# EAGLE design HV DC-DC (EAGLE 7.4.0)
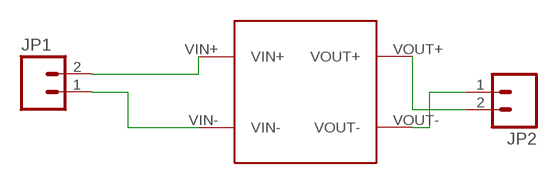
[diagram p0: schematic, sheet 1]

## Parts
JP1  M02LOCK  [1X02_LOCK]
JP2  M02LOCK  [1X02_LOCK]
U$1  RUW15SL12C  [RUW15SL12C]

## Nets
N$1: JP1.1 U$1.VIN-
N$2: JP1.2 U$1.VIN+
N$3: JP2.1 U$1.VOUT-
N$4: JP2.2 U$1.VOUT+

## Library data of the parts
JP1 JP2 = SparkFun-Connectors:M02: Standard 2-pin 0.1" header. Use with - straight break away headers ( PRT-00116) - right angle break away headers (PRT-00553) - swiss pins (PRT-00743) - machine pins (PRT-00117) - female headers (PRT-00115) Molex polarized connector foot print use with: PRT-08233 with associated crimp pins and housings. 2.54_SCREWTERM for use with PRT-10571. 3.5mm Screw Terminal footprints for PRT-08084 5mm Screw Terminal footprints for use with PRT-08432
U$1 = KylePile:RUW15SL12C

## Board
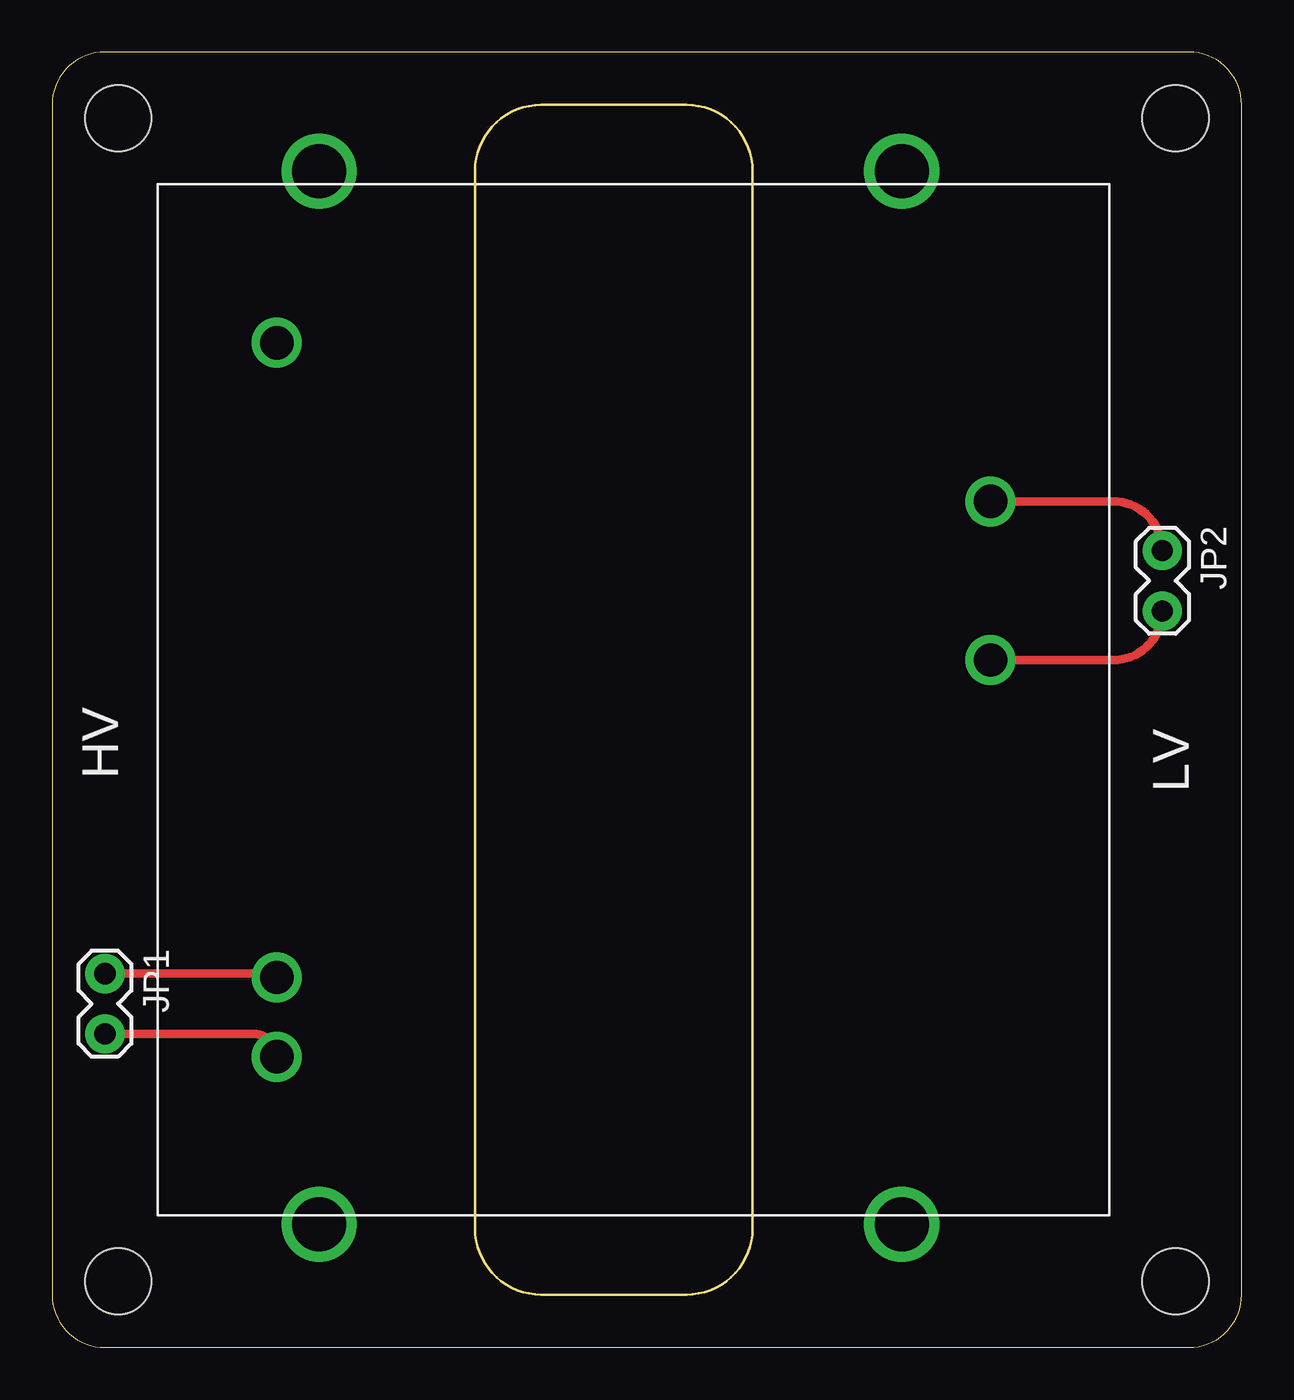
[diagram p1: board, top side]

Size 57.15 x 62.23 mm. Coordinates in mm from the lower left corner, seen from the top.
Outline: 0,59.69 0,2.54 arc90 2.54,0 54.61,0 arc90 57.15,2.54 57.15,59.69 arc90 54.61,62.23 2.54,62.23 arc90 0,59.69
Copper layers (1*16): Top 0.035mm / dielectric 1.5mm / Bottom 0.035mm
Design rules "default": minimum track width 10mil, minimum drill 24mil, track to track 8mil, track to pad 8mil, pad to pad 8mil, via to via 8mil, smd to smd 8mil, copper to edge 40mil, drill to drill 8mil, minimum pad ring 10mil, minimum via ring 8mil, stop-mask expansion 4mil, vias tented up to drill 0mil, thermal gap 10mil
Holes 3.17 mm at 3.17,59.05 53.98,59.05 53.98,3.17 3.17,3.17

### Footprints (pad centres in the part's own frame; a part is rotated, then mirrored left to right if it is on the bottom)
1X02_LOCK = drill 1.016 pad 1.88: 1 -0.178,0; 2 2.718,0
RUW15SL12C = drill 2.591: PH1 -15.113,23.495; PH2 12.878,23.495; PH3 12.878,-27.102; PH4 -15.113,-27.102 | drill 1.6: REMOTE -17.145,15.24; VIN+ -17.145,-19.05; VIN- -17.145,-15.24; VOUT+ 17.145,0; VOUT- 17.145,7.62

### Placement (x,y rotation side)
JP1  2.54,17.78 270 top
JP2  53.34,38.1 270 top
U$1  27.94,33.02 0 top

### Tracks (layer width: path | path; a pad name or v marks a point on that pad's centre or on a via)
N$1
  Top 0.406: JP1.1 11.25,17.96 arc-90 11.43,17.78 U$1.VIN-
N$2
  Top 0.406: JP1.2 9.7,15.06 arc-90 U$1.VIN+
N$3
  Top 0.406: U$1.VOUT- 50.98,40.64 arc-90 JP2.1
N$4
  Top 0.406: U$1.VOUT+ 50.98,33.02 arc90 JP2.2

### Text on the board
tPlace: HV | LV